# EAGLE design SNES (EAGLE 9.6.2)
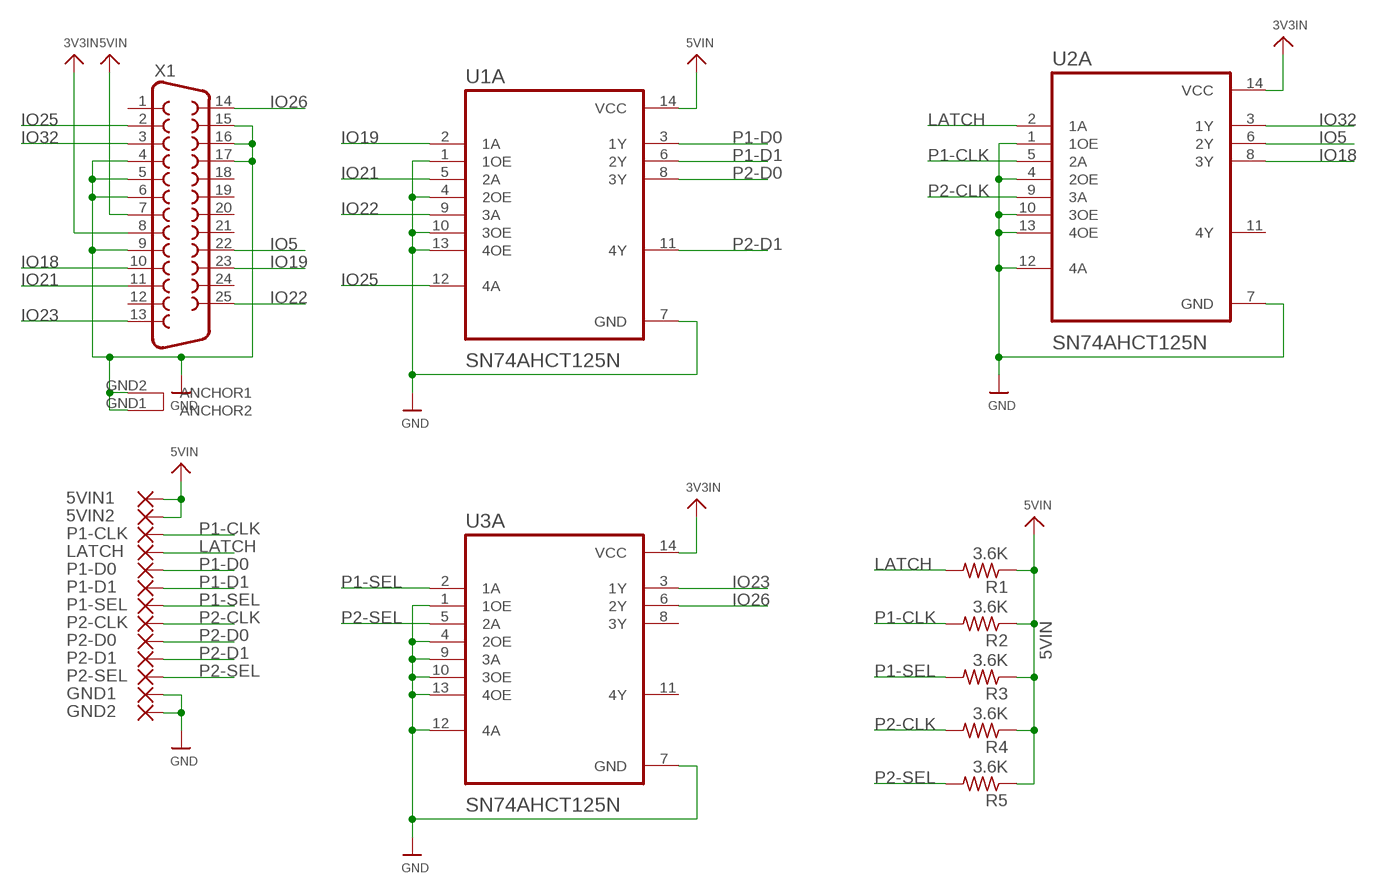
[diagram p0: schematic, sheet 1]

## Parts
5VIN1  SMD5  [SMD2,54-5,08]
5VIN2  SMD5  [SMD2,54-5,08]
GND1  SMD5  [SMD2,54-5,08]
GND2  SMD5  [SMD2,54-5,08]
LATCH  SMD5  [SMD2,54-5,08]
P1-CLK  SMD5  [SMD2,54-5,08]
P1-D0  SMD5  [SMD2,54-5,08]
P1-D1  SMD5  [SMD2,54-5,08]
P1-SEL  SMD5  [SMD2,54-5,08]
P2-CLK  SMD5  [SMD2,54-5,08]
P2-D0  SMD5  [SMD2,54-5,08]
P2-D1  SMD5  [SMD2,54-5,08]
P2-SEL  SMD5  [SMD2,54-5,08]
R1  3.6K  R-US_R1206  [R1206]
R2  3.6K  R-US_R1206  [R1206]
R3  3.6K  R-US_R1206  [R1206]
R4  3.6K  R-US_R1206  [R1206]
R5  3.6K  R-US_R1206  [R1206]
U1A  SN74AHCT125N  [DIP794W45P254L1969H508Q14]
U2A  SN74AHCT125N  [DIP794W45P254L1969H508Q14]
U3A  SN74AHCT125N  [DIP794W45P254L1969H508Q14]
X1  DB25_FEMALEHP  [F25HP]

## Nets
3V3IN: U2A.14(VCC) U3A.14(VCC) X1.8
5VIN: 5VIN1.1(P) 5VIN2.1(P) R1.1 R2.1 R3.1 R4.1 R5.1 U1A.14(VCC) X1.7
GND: GND1.1(P) GND2.1(P) U1A.1(1OE) U1A.4(2OE) U1A.7(GND) U1A.10(3OE) U1A.13(4OE) U2A.1(1OE) U2A.4(2OE) U2A.7(GND) U2A.10(3OE) U2A.12(4A) U2A.13(4OE) U3A.1(1OE) U3A.4(2OE) U3A.7(GND) U3A.9(3A) U3A.10(3OE) U3A.12(4A) U3A.13(4OE) X1.4 X1.5 X1.6 X1.9 X1.15 X1.16 X1.17 X1.GND1(ANCHOR2) X1.GND2(ANCHOR1)
IO5: U2A.6(2Y) X1.22
IO18: U2A.8(3Y) X1.10
IO19: U1A.2(1A) X1.23
IO21: U1A.5(2A) X1.11
IO22: U1A.9(3A) X1.25
IO23: U3A.3(1Y) X1.13
IO25: U1A.12(4A) X1.2
IO26: U3A.6(2Y) X1.14
IO32: U2A.3(1Y) X1.3
LATCH: LATCH.1(P) R1.2 U2A.2(1A)
P1-CLK: P1-CLK.1(P) R2.2 U2A.5(2A)
P1-D0: P1-D0.1(P) U1A.3(1Y)
P1-D1: P1-D1.1(P) U1A.6(2Y)
P1-SEL: P1-SEL.1(P) R3.2 U3A.2(1A)
P2-CLK: P2-CLK.1(P) R4.2 U2A.9(3A)
P2-D0: P2-D0.1(P) U1A.8(3Y)
P2-D1: P2-D1.1(P) U1A.11(4Y)
P2-SEL: P2-SEL.1(P) R5.2 U3A.5(2A)
Unconnected: U2A.11(4Y) U3A.8(3Y) U3A.11(4Y) X1.1 X1.12 X1.18 X1.19 X1.20 X1.21 X1.24

## Library data of the parts
5VIN1 5VIN2 GND1 GND2 LATCH P1-CLK P1-D0 P1-D1 P1-SEL P2-CLK P2-D0 P2-D1 P2-SEL = wirepad:SMD5: SMD PAD
R1-R5 = BeagleBone_Black_Wireless:R-US_: RESISTOR, American symbol
U1A U2A U3A = SN74AHCT125N:SN74AHCT125N: None Check prices <https://pricing.snapeda.com/parts/SN74AHCT125N/Texas%20Instruments/view-part?ref=eda>; AVAILABILITY: In Stock; DESCRIPTION: Quadruple Bus Buffer Gates With 3-State Outputs 14-PDIP -40 to 125; MF: Texas Instruments; MP: SN74AHCT125N; PACKAGE: PDIP-14 Texas Instruments; PRICE: None; PURCHASE-URL: https://pricing.snapeda.com/search/part/SN74AHCT125N/?ref=eda
X1 = SparkFun-Retired:DB25_FEMALE: 25 Pin male connector. PCB edge mount for regular PCB thicknesses. This connector will connect directly to the back of a PC parallel port or through a normal DB25 extension cable (M/F). SKU: PRT-08287

## Board
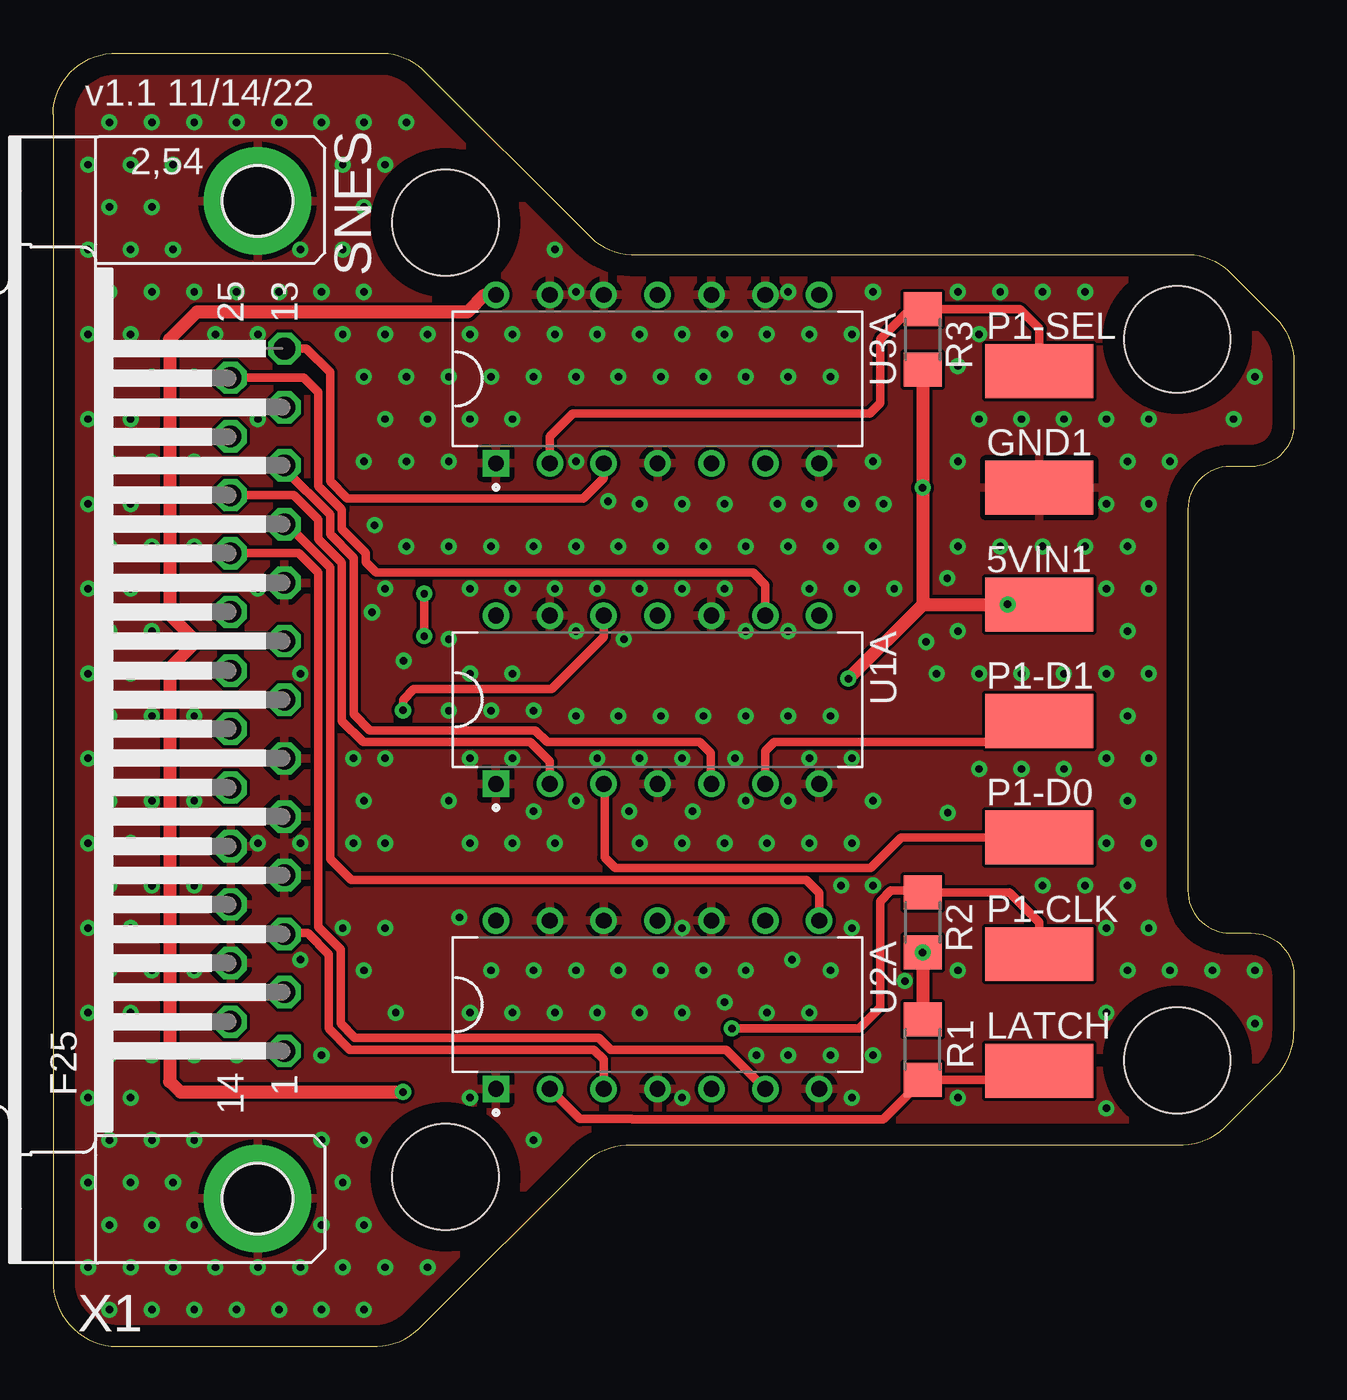
[diagram p1: board, top side]
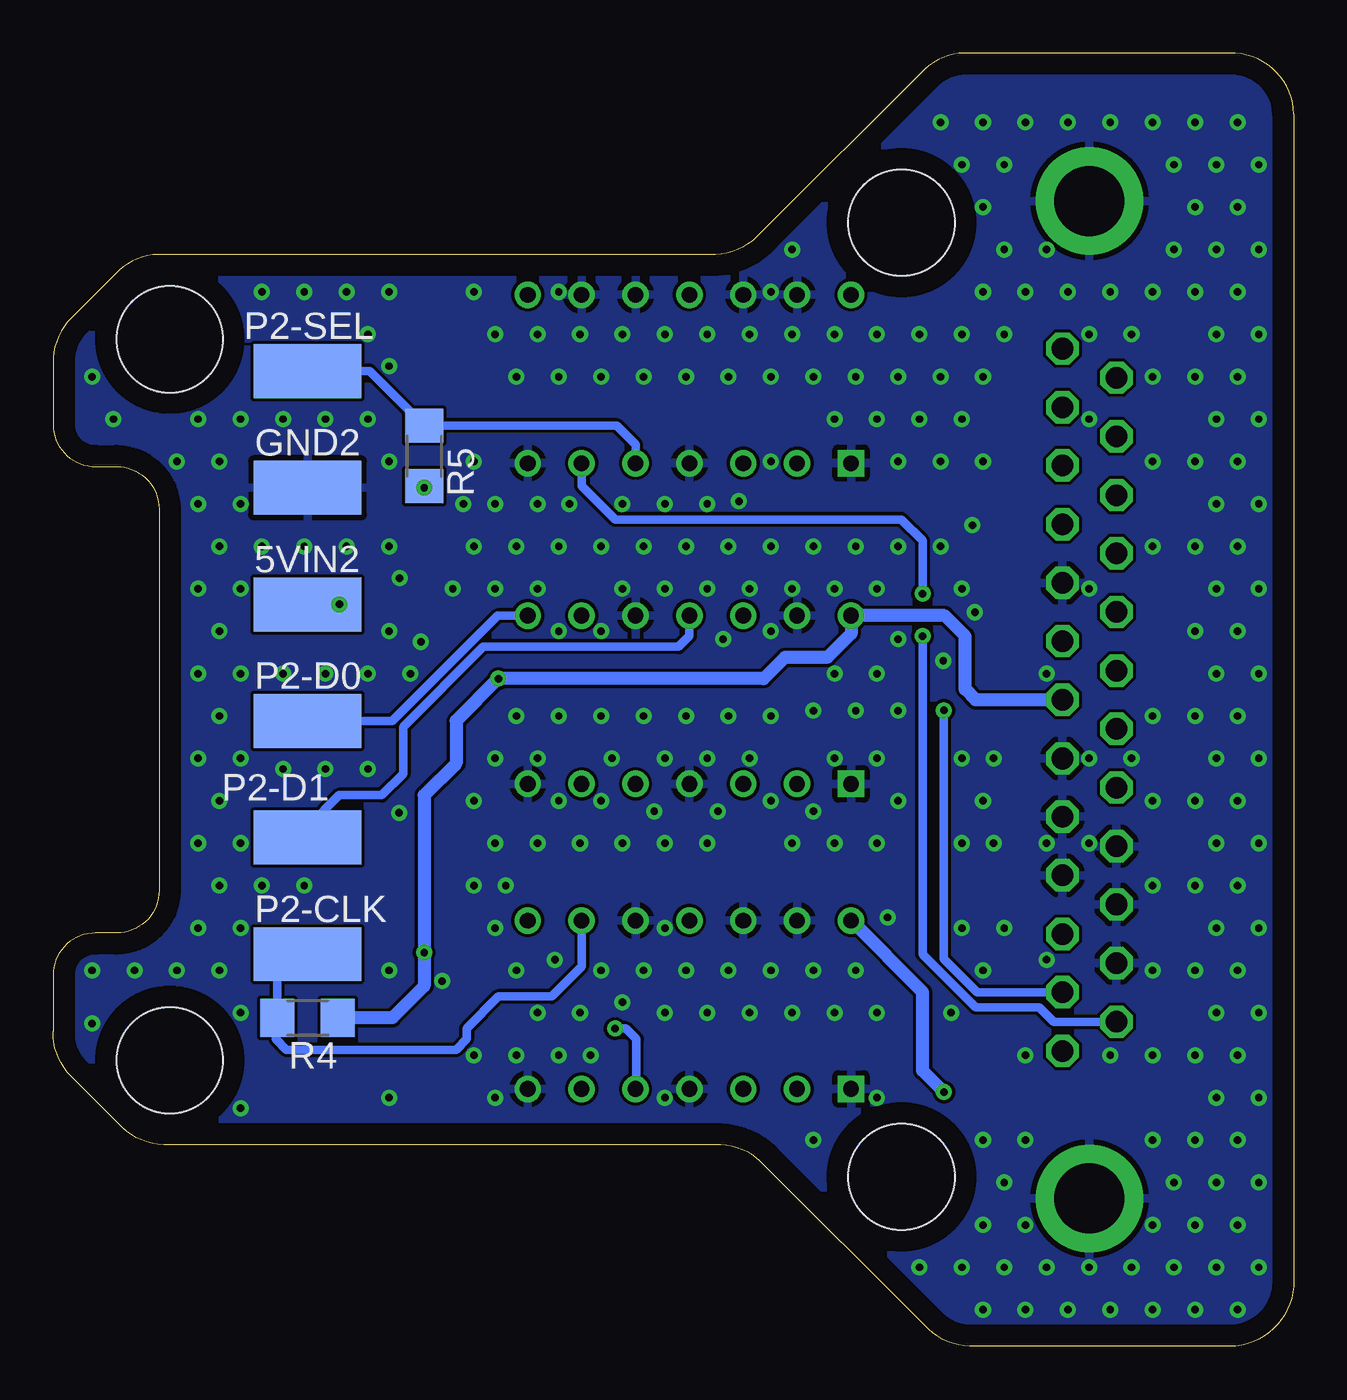
[diagram p2: board, bottom side, seen from below]

Size 58.5 x 61 mm. Coordinates in mm from the lower left corner, seen from the top.
Outline: 0,58.12 0,3.12 arc90 3.03,0 15.29,0 arc45 17.41,1 25.15,8.74 arc-45 27.27,9.5 53.29,9.5 arc45 55.41,10.5 57.65,12.74 arc45 58.5,14.86 58.5,17.5 arc90 56.5,19.5 55.5,19.5 arc-90 53.5,21.5 53.5,39.5 arc-90 55.5,41.5 56.5,41.5 arc90 58.5,43.5 58.5,46.38 arc45 57.65,48.5 55.41,50.74 arc45 53.29,51.5 27.27,51.5 arc-45 25.15,52.5 17.41,60.24 arc45 15.29,61 3.03,61 arc90 0,58.12
Copper layers (1*16): Top 0.035mm / dielectric 1.5mm / Bottom 0.035mm
Design rules "default": minimum track width 6mil, minimum drill 0.35mm, track to track 6mil, track to pad 6mil, pad to pad 6mil, via to via 6mil, smd to smd 6mil, copper to edge 40mil, drill to drill 6mil, minimum pad ring 10mil, minimum via ring 8mil, stop-mask expansion 4mil, vias tented up to drill 0.5mm, thermal gap 10mil
Holes 5 mm at 53,13.5 53,47.5 18.5,53 18.5,8

### Footprints (pad centres in the part's own frame; a part is rotated, then mirrored left to right if it is on the bottom)
SMD2,54-5,08 = smd 2.54 x 5.08: 1 0,0
R1206 = smd 1.6 x 1.803: 1 -1.422,0; 2 1.422,0
DIP794W45P254L1969H508Q14 = drill 0.74 pad 1.14 square: 1 -3.97,7.62 | drill 0.74 pad 1.14: 2 -3.97,5.08; 3 -3.97,2.54; 4 -3.97,0; 5 -3.97,-2.54; 6 -3.97,-5.08; 7 -3.97,-7.62; 8 3.97,-7.62; 9 3.97,-5.08; 10 3.97,-2.54; 11 3.97,0; 12 3.97,2.54; 13 3.97,5.08; 14 3.97,7.62
F25HP = drill 1.016 octagon: 1 -16.561,-1.27; 2 -13.792,-1.27; 3 -11.049,-1.27; 4 -8.28,-1.27; 5 -5.512,-1.27; 6 -2.769,-1.27; 7 0,-1.27; 8 2.769,-1.27; 9 5.512,-1.27; 10 8.28,-1.27; 11 11.049,-1.27; 12 13.792,-1.27; 13 16.561,-1.27; 14 -15.189,1.27; 15 -12.421,1.27; 16 -9.652,1.27; 17 -6.909,1.27; 18 -4.14,1.27; 19 -1.372,1.27; 20 1.372,1.27; 21 4.14,1.27; 22 6.909,1.27; 23 9.652,1.27; 24 12.421,1.27; 25 15.189,1.27 | drill 3.302 pad 5.08: GND1 -23.52,0; GND2 23.52,0

### Placement (x,y rotation side)
5VIN1  46.5,35 270 top
5VIN2  46.5,35 270 bottom
GND1  46.5,40.5 270 top
GND2  46.5,40.5 270 bottom
LATCH  46.5,13 270 top
P1-CLK  46.5,18.5 270 top
P1-D0  46.5,24 270 top
P1-D1  46.5,29.5 270 top
P1-SEL  46.5,46 270 top
P2-CLK  46.5,18.5 270 bottom
P2-D0  46.5,29.5 270 bottom
P2-D1  46.5,24 270 bottom
P2-SEL  46.5,46 270 bottom
R1  41,14 270 top
R2  41,20 90 top
R3  41,47.5 90 top
R4  46.5,15.5 180 bottom
R5  41,42 90 bottom
U1A  28.5,30.5 90 top
U2A  28.5,16.12 90 top
U3A  28.5,45.63 90 top
X1  9.64,30.5 90 top

### Tracks (layer width: path | path; a pad name or v marks a point on that pad's centre or on a via)
3V3IN  (via drill 0.35)
  Top 0.61: U3A.14 20.36,49.6 19.54,48.78 6.78,48.78 5.5,47.5 5.5,34.5 6.73,33.27 | 6.73,33.27 X1.8 | 6.73,33.27 6.73,33.23 5.5,32 5.5,12.5 6,12 v16.5,12
  Bottom 0.61: v16.5,12 17.5,13 17.5,16.71 U2A.14
5VIN  (via drill 0.35)
  Top 0.61: 41,35 v45,35 5VIN2.1 | R3.1 v41,40.5 41,35 | 41,35 v37.5,31.5 | R2.1 R1.1
  Bottom 0.406: 5VIN2.1 v45,35
  Bottom 0.61: X1.7 15,30.5 15.5,31 15.5,33.5 16.47,34.47 U1A.14 20.88,33.62 22,32.5 24,32.5 25,31.5 v37.5,31.5 39.5,29.5 39.5,27.5 41,26 R2.1 41,17 42.5,15.5 R4.1 | R5.1 v41,40.5
  other vias: 41,18.58
GND  (via drill 0.35)
  other vias: 2.66,1.74 1.66,3.74 2.66,5.74 1.66,7.74 2.66,9.74 1.66,11.74 2.66,13.74 1.66,15.74 2.66,17.74 1.66,19.74 2.66,21.74 1.66,23.74 2.66,25.74 1.66,27.74 2.66,29.74 1.66,31.74 2.66,33.74 1.66,35.74 2.66,37.74 1.66,39.74 2.66,41.74 1.66,43.74 2.66,45.74 1.66,47.74 2.66,49.74 1.66,51.74 2.66,53.74 1.66,55.74 2.66,57.74 4.66,1.74 3.66,3.74 4.66,5.74 3.66,7.74 4.66,9.74 3.66,11.74 4.66,13.74 3.66,15.74 4.66,17.74 3.66,19.74 4.66,21.74 3.66,23.74 4.66,25.74 3.66,27.74 4.66,29.74 3.66,31.74 4.66,33.74 3.66,35.74 4.66,37.74 3.66,39.74 4.66,41.74 3.66,43.74 4.66,45.74 3.66,47.74 4.66,49.74 3.66,51.74 4.66,53.74 3.66,55.74 4.66,57.74 6.66,1.74 5.66,3.74 6.66,5.74 5.66,7.74 6.66,9.74 6.66,13.74 6.66,17.74 6.66,21.74 6.66,25.74 6.66,29.74 6.66,37.74 6.66,41.74 6.66,45.74 6.66,49.74 5.66,51.74 5.66,55.74 6.66,57.74 8.66,1.74 7.66,3.74 8.66,13.74 7.66,27.74 7.66,47.74 8.66,49.74 8.66,57.74 10.66,1.74 9.66,3.74 11.66,18.24 9.66,23.74 9.66,27.74 9.66,35.74 9.66,43.74 9.66,47.74 10.66,49.74 10.66,57.74 12.66,1.74 11.66,3.74 12.66,5.74 12.66,9.74 12.66,13.74 11.66,23.74 11.66,31.74 12.66,49.74 11.66,51.74 12.66,57.74 14.66,1.74 13.66,3.74 14.66,5.74 13.66,7.74 14.66,9.74 14.66,17.74 13.66,19.74 14.16,23.74 14.66,25.74 14.16,27.74 15.04,34.62 14.66,41.74 15.16,38.74 14.66,45.74 13.66,47.74 14.66,49.74 13.66,51.74 14.66,53.74 13.66,55.74 14.66,57.74 15.66,3.74 16.16,15.74 15.66,19.74 15.66,23.74 15.66,27.74 16.53,32.34 15.66,35.74 16.66,37.74 16.66,41.74 15.66,43.74 16.66,45.74 15.66,47.74 15.66,55.74 16.66,57.74 17.66,3.74 18.66,25.74 18.66,29.99 18.66,33.35 18.66,37.74 18.66,41.74 17.66,43.74 18.66,45.74 17.66,47.74 19.66,11.74 19.66,15.74 20.66,17.74 19.16,20.24 19.66,23.74 19.66,27.74 20.66,29.99 19.66,31.74 19.66,35.74 20.66,37.74 19.66,43.74 20.66,45.74 19.66,47.74 22.66,9.74 21.66,15.74 22.66,17.74 21.66,23.74 22.66,25.24 21.66,27.74 22.66,29.99 21.66,31.74 21.66,35.74 22.66,37.74 21.66,43.74 22.66,45.74 21.66,47.74 23.66,15.74 24.66,17.74 23.66,23.74 24.66,25.74 24.66,29.74 24.66,33.74 23.66,35.74 24.66,37.74 24.66,41.74 24.66,45.74 23.66,47.74 24.66,49.74 23.66,51.74 25.66,15.74 26.66,17.74 27.16,25.24 25.66,27.74 26.66,29.74 26.91,33.35 25.66,35.74 26.66,37.74 26.16,39.86 26.66,45.74 25.66,47.74 27.66,15.74 28.66,17.74 27.66,23.74 27.66,27.74 28.66,29.74 27.66,35.74 28.66,37.74 27.66,39.74 28.66,45.74 27.66,47.74 29.66,11.74 29.66,15.74 30.66,17.74 29.66,19.74 29.66,23.74 30.16,25.24 29.66,27.74 30.66,29.74 29.66,35.74 30.66,37.74 29.66,39.74 30.66,45.74 29.66,47.74 33.16,13.74 31.66,16.24 32.66,17.74 31.66,23.74 32.66,25.74 32.16,27.74 32.66,29.74 32.66,33.74 31.66,35.74 32.66,37.74 31.66,39.74 32.66,45.74 31.66,47.74 34.66,13.74 33.66,15.74 34.84,18.24 33.66,23.74 34.66,25.74 34.66,29.74 34.66,33.74 34.66,37.74 34.16,39.74 34.66,45.74 33.66,47.74 34.66,49.74 36.66,13.74 35.66,15.74 36.66,17.74 37.16,21.74 35.66,23.74 35.66,27.74 36.66,29.74 35.66,35.74 36.66,37.74 35.66,39.74 36.66,45.74 35.66,47.74 37.66,11.74 38.66,13.74 37.66,19.74 38.66,21.74 37.66,23.74 38.66,25.74 37.66,27.74 37.66,35.74 38.66,37.74 37.66,39.74 38.66,41.74 37.66,47.74 38.66,49.74 42.66,11.74 40.16,17.24 42.18,25.16 41.16,33.24 39.66,35.74 39.16,39.74 42.66,17.74 49.66,11.24 41.66,31.74 42.66,33.74 42.16,36.24 42.66,37.74 42.66,41.74 42.66,46.24 42.66,49.74 43.66,27.24 43.66,31.74 44.66,37.74 43.66,43.74 43.66,47.74 44.66,49.74 46.66,21.74 45.66,27.24 45.66,31.74 46.66,37.74 45.66,43.74 46.66,49.74 48.66,21.74 47.66,27.24 47.66,31.74 48.66,37.74 47.66,43.74 48.66,49.74 49.66,15.74 50.66,17.74 49.66,19.74 50.66,21.74 49.66,23.74 50.66,25.74 49.66,27.74 50.66,29.74 49.66,31.74 50.66,33.74 49.66,35.74 50.66,37.74 49.66,39.74 50.66,41.74 49.66,43.74 52.66,17.74 51.66,19.74 51.66,23.74 51.66,27.74 51.66,31.74 51.66,35.74 51.66,39.74 52.66,41.74 51.66,43.74 54.66,17.74 56.66,15.24 56.66,17.74 55.66,43.74 56.66,45.74
  pour Bottom: 0,0 0,61.12 28.53,61.12 28.53,51.62 59.03,51.62 59.03,9.5 28.03,9.5 28.03,0
  pour Top: 0,0 0,61.12 28.53,61.12 28.53,51.62 59.03,51.62 59.03,9.5 28.03,9.5 28.03,0
IO5
  Top 0.406: U2A.6 31.73,14 26.29,14 25.73,14.56 14.23,14.56 13.56,15.23 13.56,18.73 12.5,19.79 12.5,36.5 11.59,37.41 X1.22
IO18
  Top 0.406: U2A.8 36.12,21.38 35.5,22 14.06,22 13.06,23 13.06,36.73 11.01,38.78 X1.10
IO19
  Top 0.406: U1A.2 23.42,27.58 22.5,28.5 14.62,28.5 13.62,29.5 13.62,36.96 12.5,38.08 12.5,39 11.35,40.15 X1.23
IO21
  Top 0.406: U1A.5 31,26.57 31,28 30.5,28.5 23.29,28.5 22.73,29.06 14.94,29.06 14.18,29.82 14.18,37.19 13.06,38.31 13.06,39.23 10.91,41.38 X1.11
IO22
  Top 0.406: U1A.9 33.58,35.92 33,36.5 15.23,36.5 14.73,37 14.73,37.43 13.62,38.54 13.62,39.46 12.5,40.58 12.5,45 11.81,45.69 X1.25
IO23
  Top 0.406: U3A.3 25.96,40.96 25,40 13.87,40 13.06,40.81 13.06,45.94 11.94,47.06 X1.13
IO25  (via drill 0.35)
  Top 0.406: v16.5,30 16.5,30.5 17,31 23.5,31 25.96,33.46 U1A.12
  Bottom 0.406: X1.2 14.92,16.71 16.5,18.29 v16.5,30
IO26  (via drill 0.35)
  Top 0.406: v17.5,33.5 v17.5,35.5
  Bottom 0.406: X1.14 11.31,15.31 12,16 15,16 17.5,18.5 v17.5,33.5 | v17.5,35.5 17.5,38 18.5,39 32,39 33.58,40.58 U3A.6
IO32
  Top 0.406: U2A.3 25.96,13.54 25.5,14 14,14 13,15 13,18.5 12,19.5 10.96,19.5 X1.3
LATCH
  Top 0.406: U2A.2 24.84,10.73 27.29,10.73 27.3,10.72 39.14,10.72 R1.2 46.08,12.58 LATCH.1
P1-CLK  (via drill 0.35)
  Top 0.406: v32,15 38,15 39,16 39,21 39.5,21.5 40.92,21.5 R2.2 45.08,21.42 46.5,20 P1-CLK.1
  Bottom 0.406: U2A.5 31,12.19 31,14.5 31.5,15 v32,15
P1-D0
  Top 0.406: U1A.3 26,26.49 26,23.06 26.5,22.56 38.56,22.56 40,24 P1-D0.1
P1-D1
  Top 0.406: U1A.6 33.58,28.08 34,28.5 45.5,28.5 P1-D1.1
P1-SEL
  Top 0.406: P1-SEL.1 46.5,48 45.58,48.92 R3.2 40.42,48.92 39,47.5 39,44.5 38.5,44 24.5,44 23.42,42.92 U3A.2
P2-CLK
  Bottom 0.406: U2A.9 33.58,17.92 35,16.5 37.5,16.5 39,15 39,14.5 39.5,14 47.5,14 48,14.5 48,15.42 R4.2 47.92,17.92 48,18 47.5,18.5 P2-CLK.1
P2-D0
  Bottom 0.406: U1A.8 37.53,34.47 42.5,29.5 P2-D0.1
P2-D1
  Bottom 0.406: U1A.11 28.5,33.5 29,33 38.21,33 42,29.21 42,27 43,26 45,26 46.5,24.5 P2-D1.1
P2-SEL
  Bottom 0.406: U3A.5 31.04,42.54 31.92,43.42 R5.2 43.58,46 P2-SEL.1

### Text on the board
tPlace: v1.1 11/14/22 | SNES